# EAGLE schematic skatelight (EAGLE 5.04)
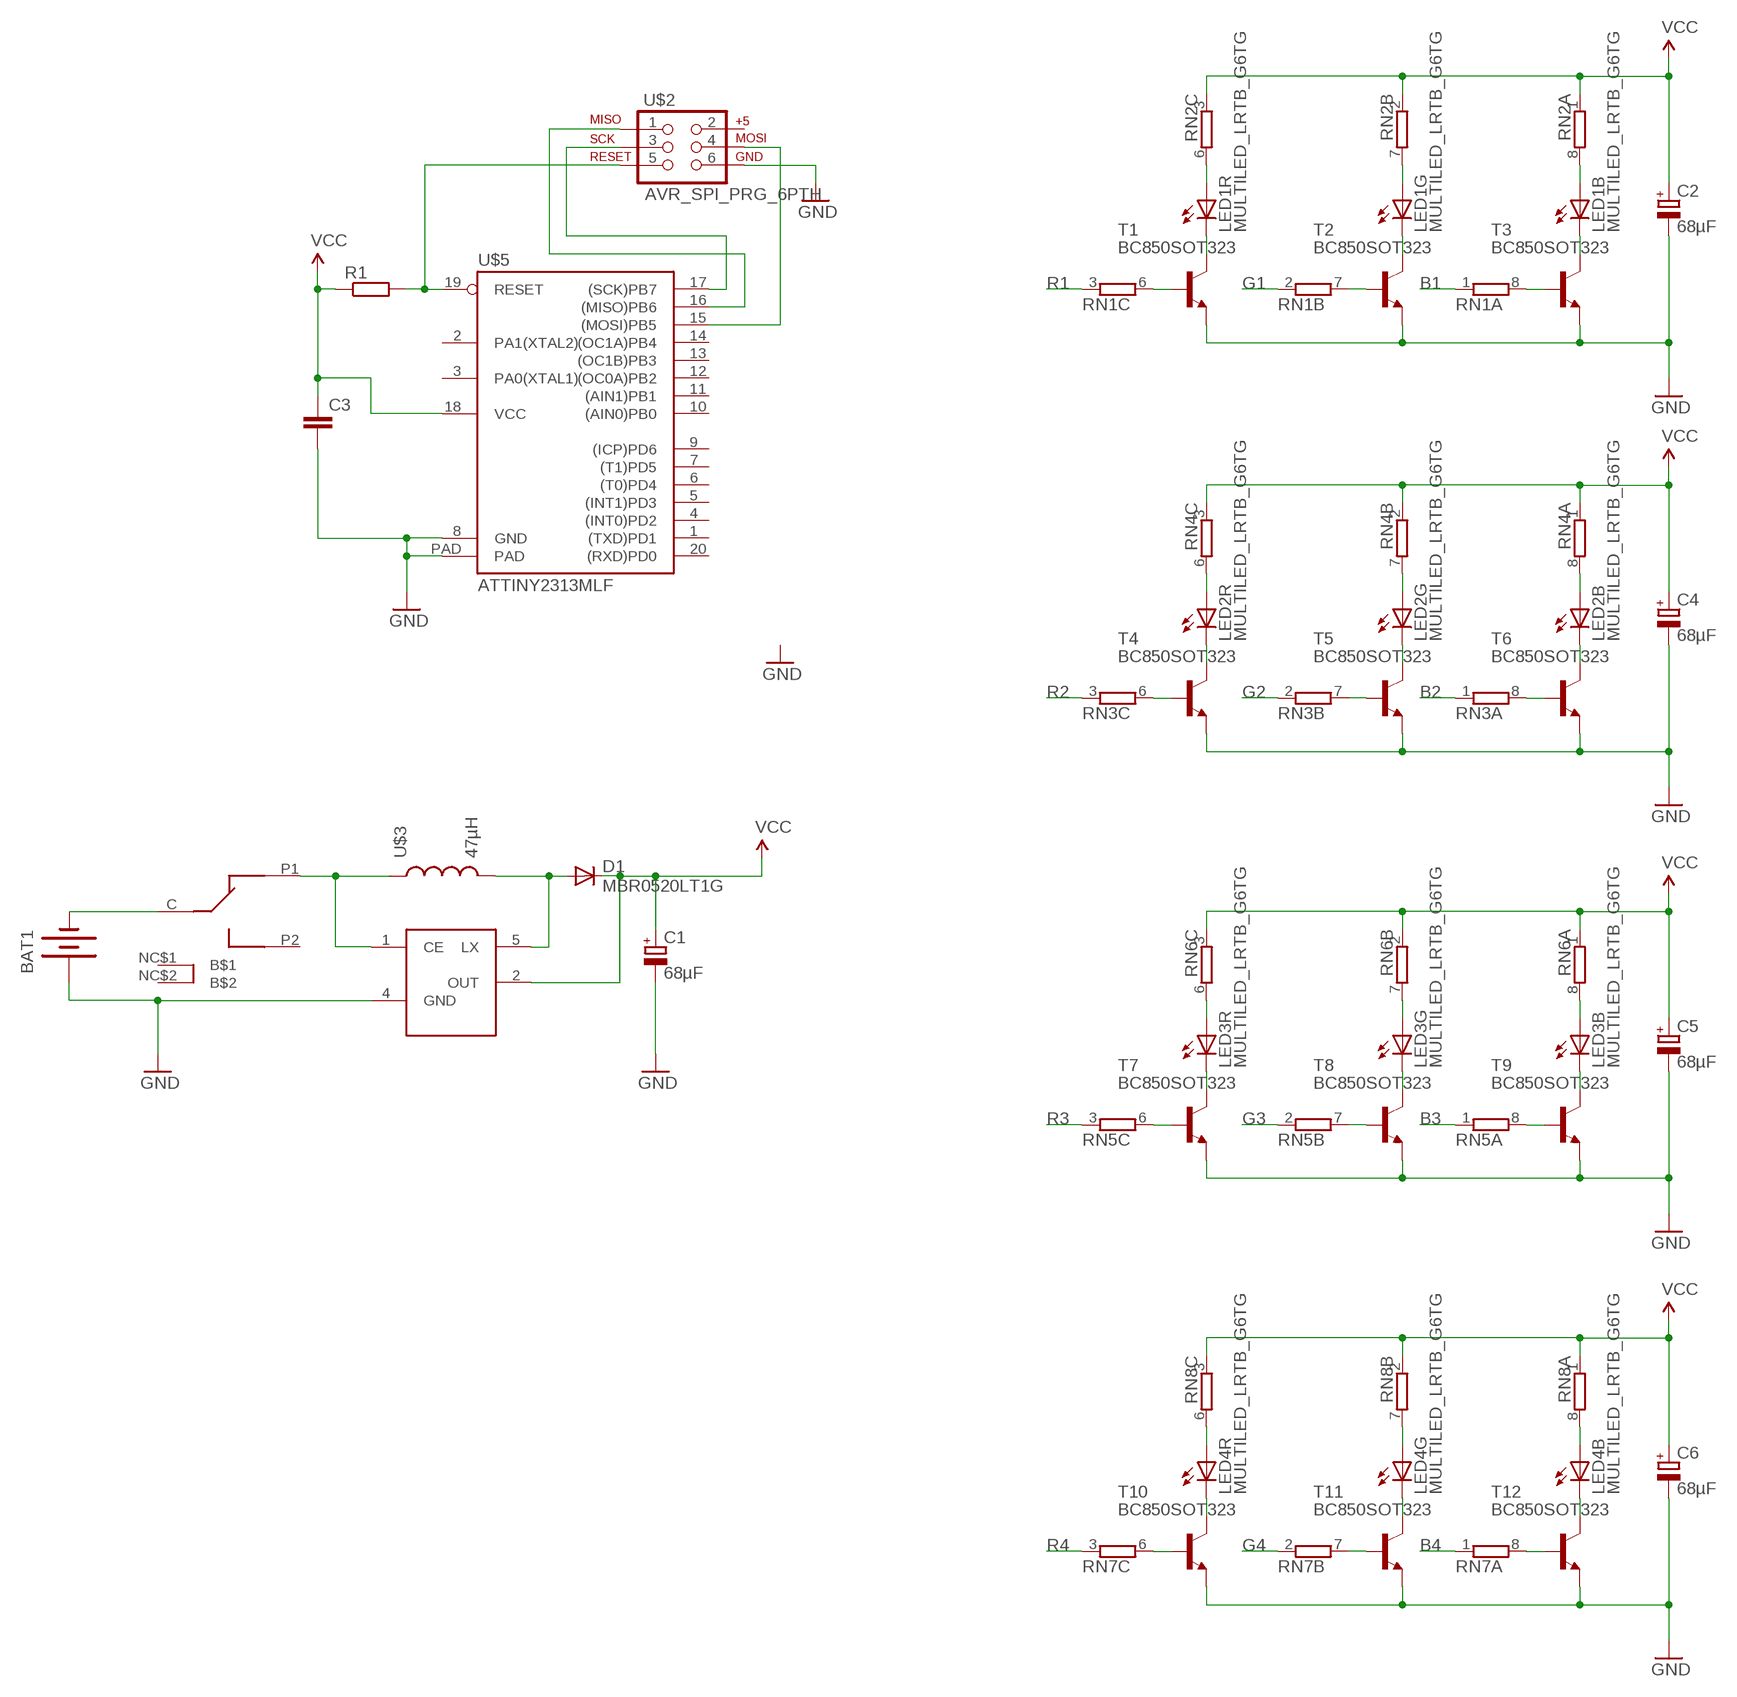
[diagram p0: schematic, sheet 1]

## Parts
BAT1  BATTERYAA  [BATTERY-AA]
C1  68µF  CPOL-EUD  [PANASONIC_D]
C2  68µF  CPOL-EUD  [PANASONIC_D]
C3  C-EUC0603  [C0603]
C4  68µF  CPOL-EUD  [PANASONIC_D]
C5  68µF  CPOL-EUD  [PANASONIC_D]
C6  68µF  CPOL-EUD  [PANASONIC_D]
D1  MBR0520LT1G  CGRM4001-G  [SOD-123_MINI-SMA]
LED1  MULTILED_LRTB_G6TG  [P-LCC-6_TOPLED]
LED2  MULTILED_LRTB_G6TG  [P-LCC-6_TOPLED]
LED3  MULTILED_LRTB_G6TG  [P-LCC-6_TOPLED]
LED4  MULTILED_LRTB_G6TG  [P-LCC-6_TOPLED]
R1  R-EU_R0603  [R0603]
RN1  4R-NCAY16  [CAY16]
RN2  4R-NCAT16  [CAT16]
RN3  4R-NCAY16  [CAY16]
RN4  4R-NCAT16  [CAT16]
RN5  4R-NCAY16  [CAY16]
RN6  4R-NCAT16  [CAT16]
RN7  4R-NCAY16  [CAY16]
RN8  4R-NCAT16  [CAT16]
T1  BC850SOT323  [SOT323-BEC]
T2  BC850SOT323  [SOT323-BEC]
T3  BC850SOT323  [SOT323-BEC]
T4  BC850SOT323  [SOT323-BEC]
T5  BC850SOT323  [SOT323-BEC]
T6  BC850SOT323  [SOT323-BEC]
T7  BC850SOT323  [SOT323-BEC]
T8  BC850SOT323  [SOT323-BEC]
T9  BC850SOT323  [SOT323-BEC]
T10  BC850SOT323  [SOT323-BEC]
T11  BC850SOT323  [SOT323-BEC]
T12  BC850SOT323  [SOT323-BEC]
U$1  SMDSWITCHAYZ0102  [SMDSWITCH]
U$2  AVR_SPI_PRG_6PTH  [2X3]
U$3  47µH  INDUCTORCDRH62B  [CDRH62BNP-470MC]
U$4  NCP1402  [SOT23-5]
U$5  ATTINY2313MLF  [MLF20]

## Nets
B1: RN1.1
B2: RN3.1
B3: RN5.1
B4: RN7.1
G1: RN1.2
G2: RN3.2
G3: RN5.2
G4: RN7.2
GND: BAT1.PWR@1(+) C1.- C2.- C3.2 C4.- C5.- C6.- T1.E T2.E T3.E T4.E T5.E T6.E T7.E T8.E T9.E T10.E T11.E T12.E U$2.6 U$4.4(GND) U$5.8(GND) U$5.PAD
N$1: U$2.3 U$5.17((SCK)PB7)
N$2: R1.2 U$2.5 U$5.19(RESET)
N$3: U$2.4 U$5.15((MOSI)PB5)
N$4: U$2.1 U$5.16((MISO)PB6)
N$5: LED1.A1(R:A) RN2.6
N$6: LED1.C1(R:C) T1.C
N$7: RN1.6 T1.B
N$8: LED2.A1(R:A) RN4.6
N$9: LED2.C1(R:C) T4.C
N$10: RN1.7 T2.B
N$11: RN1.8 T3.B
N$12: RN3.6 T4.B
N$13: LED1.A2(G:A) RN2.7
N$14: LED1.A3(B:A) RN2.8
N$15: LED1.C3(B:C) T3.C
N$16: LED1.C2(G:C) T2.C
N$17: RN3.7 T5.B
N$18: RN3.8 T6.B
N$19: LED2.A2(G:A) RN4.7
N$20: LED2.A3(B:A) RN4.8
N$21: U$1.P1 U$3.P$1 U$4.1(CE)
N$22: D1.A U$3.P$2 U$4.5(LX)
N$23: BAT1.GND@1(-) U$1.C
N$24: LED2.C3(B:C) T6.C
N$25: LED2.C2(G:C) T5.C
N$26: LED3.A1(R:A) RN6.6
N$27: LED3.C1(R:C) T7.C
N$28: RN5.6 T7.B
N$29: RN5.7 T8.B
N$30: RN5.8 T9.B
N$31: LED3.A2(G:A) RN6.7
N$32: LED3.A3(B:A) RN6.8
N$33: LED3.C3(B:C) T9.C
N$34: LED3.C2(G:C) T8.C
N$35: LED4.A1(R:A) RN8.6
N$36: LED4.C1(R:C) T10.C
N$37: RN7.6 T10.B
N$38: RN7.7 T11.B
N$39: RN7.8 T12.B
N$40: LED4.A2(G:A) RN8.7
N$41: LED4.A3(B:A) RN8.8
N$42: LED4.C3(B:C) T12.C
N$43: LED4.C2(G:C) T11.C
R1: RN1.3
R2: RN3.3
R3: RN5.3
R4: RN7.3
VCC: C1.+ C2.+ C3.1 C4.+ C5.+ C6.+ D1.C R1.1 RN2.1 RN2.2 RN2.3 RN4.1 RN4.2 RN4.3 RN6.1 RN6.2 RN6.3 RN8.1 RN8.2 RN8.3 U$4.2(OUT) U$5.18(VCC)
Unconnected: RN1.4 RN1.5 RN2.4 RN2.5 RN3.4 RN3.5 RN4.4 RN4.5 RN5.4 RN5.5 RN6.4 RN6.5 RN7.4 RN7.5 RN8.4 RN8.5 U$1.NC$1(B$1) U$1.NC$2(B$2) U$1.P2 U$2.2 U$5.1((TXD)PD1) U$5.2(PA1(XTAL2)) U$5.3(PA0(XTAL1)) U$5.4((INT0)PD2) U$5.5((INT1)PD3) U$5.6((T0)PD4) U$5.7((T1)PD5) U$5.9((ICP)PD6) U$5.10((AIN0)PB0) U$5.11((AIN1)PB1) U$5.12((OC0A)PB2) U$5.13((OC1B)PB3) U$5.14((OC1A)PB4) U$5.20((RXD)PD0)

## Library data of the parts
BAT1 = SparkFun:BATTERY: Battery Holders Various common sizes : AA, AAA, 20mm coin cell and 12mm coin cell.
C1 C2 C4-C6 = rcl:CPOL-EU: POLARIZED CAPACITOR, European symbol
C3 = rcl:C-EU: CAPACITOR, European symbol
D1 = diode:CGRM400*-G: Molded plasitc,JEDEC SOD-123/Mini SMA Source: Comchip CGRM4001-G.pdf
LED1-LED4 = led:MULTILED_LRTB_G6TG: 6-lead MULTILED® Enhanced optical Power LED (ThinFilm® / ThinGaN®) Source. OSRAM - LRTB_G6TG.pdf
R1 = rcl:R-EU_: RESISTOR, European symbol
RN1-RN8 = resistor-dil:4R-N: Array Chip Resistor Source: RS Component / Phycomp
T1-T12 = additional:BC850: NPN TRANSISTOR
U$1 = additional:SMDSWITCH: C&K Components AYZ0102AGRLC
U$2 = SparkFun:AVR_SPI_PRG_6: AVR ISP 6 Pin This is the reduced ISP connector for AVR programming. Common on Arduino. This footprint will take up less PCB space and can be used with a 10-pin to 6-pin adapter such as SKU: BOB-08508
U$3 = additional:INDUCTOR: Inductors Basic Inductor/Choke - 0603 and 1206. Footprints are not proven and vary greatly between part numbers.
U$4 = additional:NCP1402
U$5 = additional:ATTINY2313